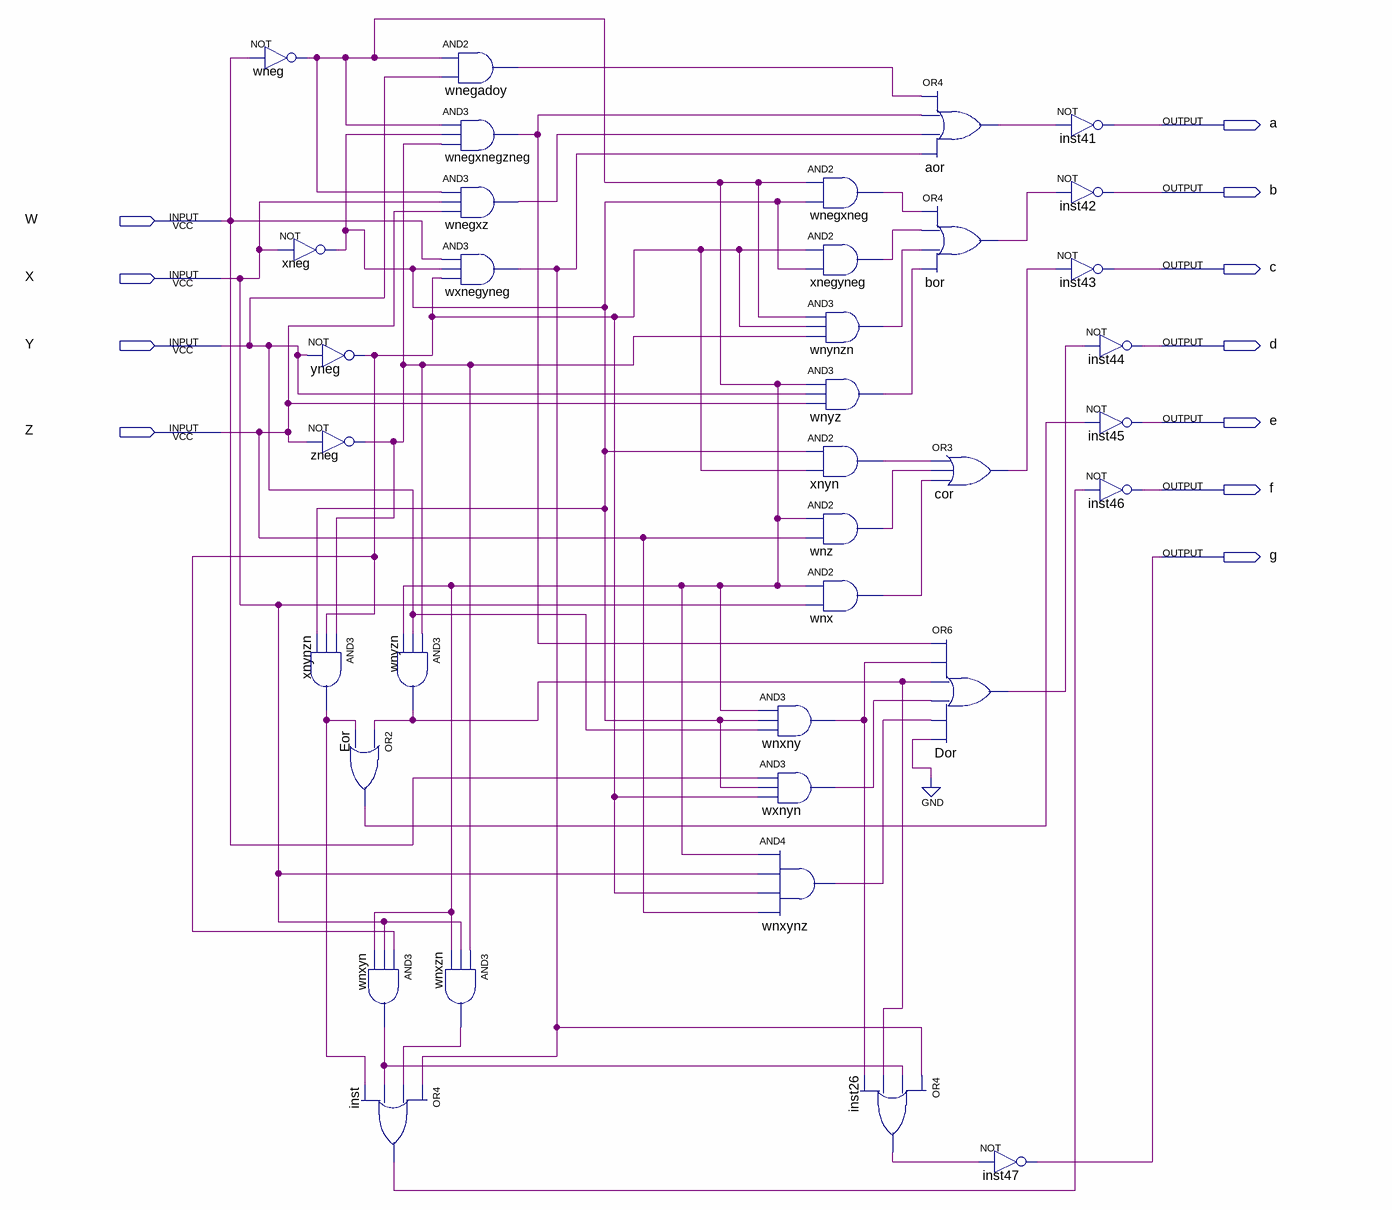
[diagram p0: schematic sheet]
// Quartus schematic Display.bdf as structural Verilog: 36 symbols, 11 pins
module Display (
  input  W,
  input  X,
  input  Y,
  input  Z,
  output a,
  output b,
  output c,
  output d,
  output e,
  output f,
  output g
);

  wire aor_out, bor_out, cor_out, Dor_out, Eor_out, inst26_out, inst_out, wneg_out, wnegadoy_out,
       wnegxneg_out, wnegxnegzneg_out, wnegxz_out, wnx_out, wnxny_out, wnxyn_out, wnxynz_out, wnxzn_out,
       wnynzn_out, wnyz_out, wnyzn_out, wnz_out, wxnegyneg_out, wxnyn_out, xneg_out, xnegyneg_out, xnyn_out,
       xnynzn_out, yneg_out, zneg_out;

  not wneg (wneg_out, W);
  not xneg (xneg_out, X);
  not yneg (yneg_out, Y);
  not zneg (zneg_out, Z);
  and xnynzn (xnynzn_out, zneg_out, yneg_out, xneg_out);
  or Eor (Eor_out, wnyzn_out, xnynzn_out);
  and wnxyn (wnxyn_out, yneg_out, X, wneg_out);
  or inst (inst_out, wxnegyneg_out, wnxzn_out, wnxyn_out, xnynzn_out);
  and wnegadoy (wnegadoy_out, wneg_out, Y);
  and wnegxnegzneg (wnegxnegzneg_out, wneg_out, xneg_out, zneg_out);
  and wnegxz (wnegxz_out, wneg_out, X, Z);
  and wxnegyneg (wxnegyneg_out, W, xneg_out, yneg_out);
  and wnyzn (wnyzn_out, zneg_out, Y, wneg_out);
  and wnxzn (wnxzn_out, zneg_out, X, wneg_out);
  and wnegxneg (wnegxneg_out, wneg_out, xneg_out);
  and xnegyneg (xnegyneg_out, yneg_out, xneg_out);
  and wnynzn (wnynzn_out, wneg_out, yneg_out, zneg_out);
  and wnyz (wnyz_out, wneg_out, Y, Z);
  and xnyn (xnyn_out, xneg_out, yneg_out);
  and wnz (wnz_out, wneg_out, Z);
  and wnx (wnx_out, wneg_out, X);
  and wnxny (wnxny_out, wneg_out, xneg_out, Y);
  and wxnyn (wxnyn_out, W, xneg_out, yneg_out);
  and wnxynz (wnxynz_out, wneg_out, X, yneg_out, Z);
  or inst26 (inst26_out, wxnegyneg_out, wnxyn_out, wnyzn_out, wnxny_out);
  or aor (aor_out, wnegadoy_out, wnegxnegzneg_out, wnegxz_out, wxnegyneg_out);
  or bor (bor_out, wnegxneg_out, xnegyneg_out, wnynzn_out, wnyz_out);
  or cor (cor_out, xnyn_out, wnz_out, wnx_out);
  or Dor (Dor_out, wnegxnegzneg_out, wnxny_out, wnyzn_out, wxnyn_out, wnxynz_out, 1'b0);
  not inst47 (g, inst26_out);
  not inst41 (a, aor_out);
  not inst42 (b, bor_out);
  not inst43 (c, cor_out);
  not inst44 (d, Dor_out);
  not inst45 (e, Eor_out);
  not inst46 (f, inst_out);
endmodule
